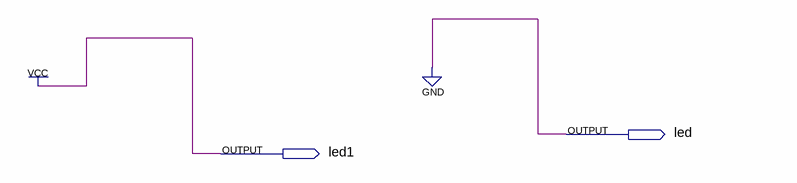
[diagram p0: schematic sheet]
// Quartus schematic testeteste.bdf as structural Verilog: 0 symbols, 2 pins
module testeteste (
  output led,
  output led1
);


  assign led = 1'b0;
  assign led1 = 1'b1;
endmodule
